# Altium schematic sheet FPGA_IO_4.SchDoc
size A
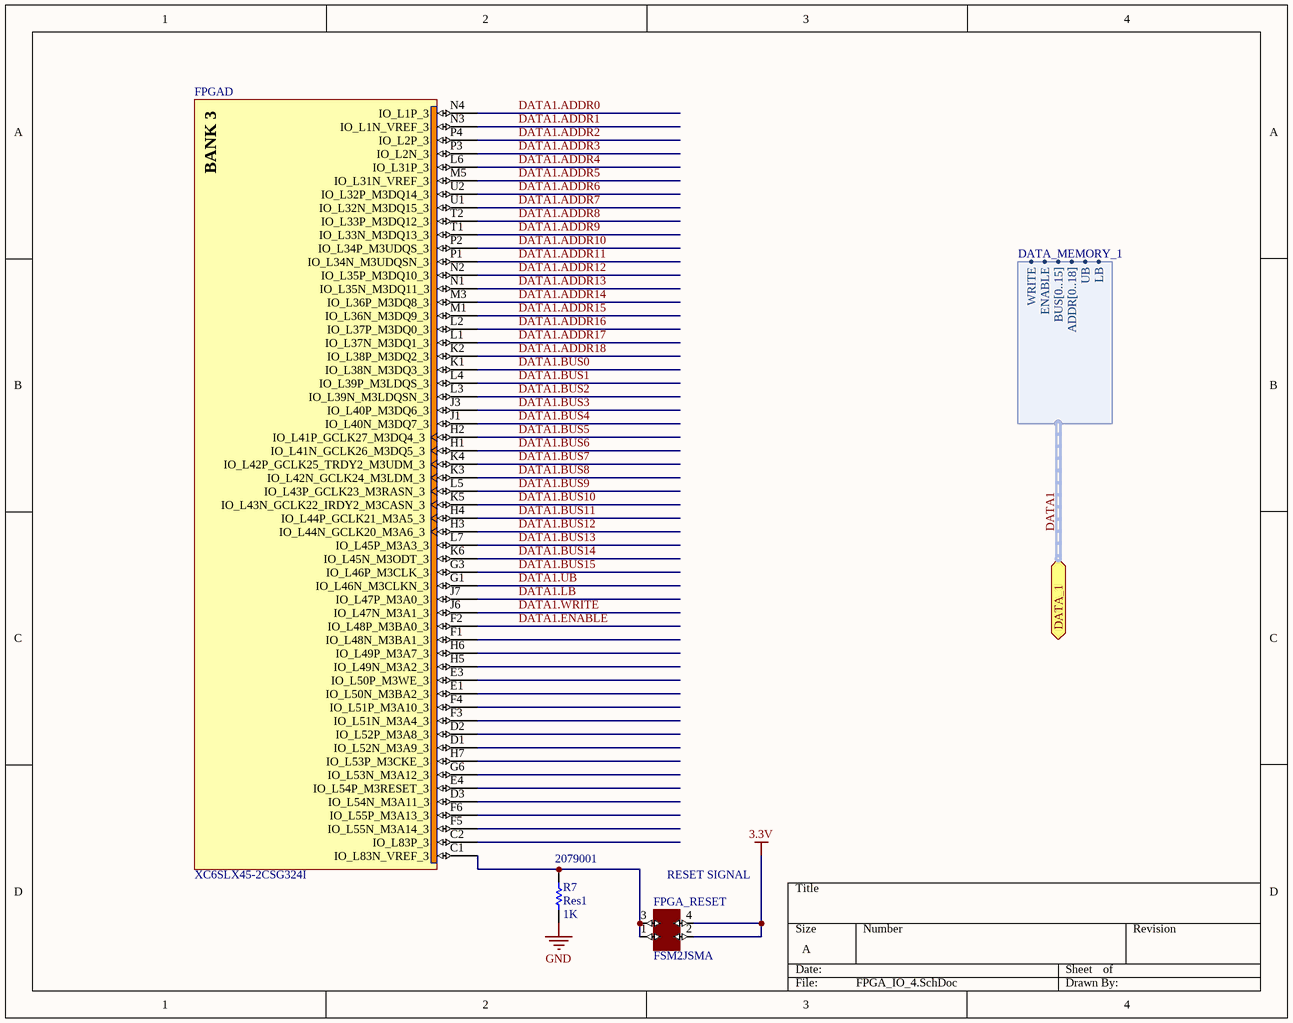
[diagram p0: FPGA_IO_4.SchDoc]

## Parts
FPGA  XC6SLX45-2CSG324I  [CSG324]  (part D of 8)
FPGA_RESET  FSM2JSMA  [Button]
R7  Res1  value 1K  Supplier Part Number 1: 2079001  [C1206]

## Ports
DATA_1 (harness DATA_MEMORY_1)

## Harnesses
DATA_MEMORY_1: WRITE, ENABLE, BUS[0..15], ADDR[0..18], UB, LB

## Nets
3.3V: FPGA_RESET.2 FPGA_RESET.4
GND: R7.2
DATA1.ADDR0: FPGA.N4(IO_L1P_3)
DATA1.ADDR1: FPGA.N3(IO_L1N_VREF_3)
DATA1.ADDR2: FPGA.P4(IO_L2P_3)
DATA1.ADDR3: FPGA.P3(IO_L2N_3)
DATA1.ADDR4: FPGA.L6(IO_L31P_3)
DATA1.ADDR5: FPGA.M5(IO_L31N_VREF_3)
DATA1.ADDR6: FPGA.U2(IO_L32P_M3DQ14_3)
DATA1.ADDR7: FPGA.U1(IO_L32N_M3DQ15_3)
DATA1.ADDR8: FPGA.T2(IO_L33P_M3DQ12_3)
DATA1.ADDR9: FPGA.T1(IO_L33N_M3DQ13_3)
DATA1.ADDR10: FPGA.P2(IO_L34P_M3UDQS_3)
DATA1.ADDR11: FPGA.P1(IO_L34N_M3UDQSN_3)
DATA1.ADDR12: FPGA.N2(IO_L35P_M3DQ10_3)
DATA1.ADDR13: FPGA.N1(IO_L35N_M3DQ11_3)
DATA1.ADDR14: FPGA.M3(IO_L36P_M3DQ8_3)
DATA1.ADDR15: FPGA.M1(IO_L36N_M3DQ9_3)
DATA1.ADDR16: FPGA.L2(IO_L37P_M3DQ0_3)
DATA1.ADDR17: FPGA.L1(IO_L37N_M3DQ1_3)
DATA1.ADDR18: FPGA.K2(IO_L38P_M3DQ2_3)
DATA1.BUS0: FPGA.K1(IO_L38N_M3DQ3_3)
DATA1.BUS1: FPGA.L4(IO_L39P_M3LDQS_3)
DATA1.BUS2: FPGA.L3(IO_L39N_M3LDQSN_3)
DATA1.BUS3: FPGA.J3(IO_L40P_M3DQ6_3)
DATA1.BUS4: FPGA.J1(IO_L40N_M3DQ7_3)
DATA1.BUS5: FPGA.H2(IO_L41P_GCLK27_M3DQ4_3)
DATA1.BUS6: FPGA.H1(IO_L41N_GCLK26_M3DQ5_3)
DATA1.BUS7: FPGA.K4(IO_L42P_GCLK25_TRDY2_M3UDM_3)
DATA1.BUS8: FPGA.K3(IO_L42N_GCLK24_M3LDM_3)
DATA1.BUS9: FPGA.L5(IO_L43P_GCLK23_M3RASN_3)
DATA1.BUS10: FPGA.K5(IO_L43N_GCLK22_IRDY2_M3CASN_3)
DATA1.BUS11: FPGA.H4(IO_L44P_GCLK21_M3A5_3)
DATA1.BUS12: FPGA.H3(IO_L44N_GCLK20_M3A6_3)
DATA1.BUS13: FPGA.L7(IO_L45P_M3A3_3)
DATA1.BUS14: FPGA.K6(IO_L45N_M3ODT_3)
DATA1.BUS15: FPGA.G3(IO_L46P_M3CLK_3)
DATA1.ENABLE: FPGA.F2(IO_L48P_M3BA0_3)
DATA1.LB: FPGA.J7(IO_L47P_M3A0_3)
DATA1.UB: FPGA.G1(IO_L46N_M3CLKN_3)
DATA1.WRITE: FPGA.J6(IO_L47N_M3A1_3)
NetFPGA_C1: FPGA.C1(IO_L83N_VREF_3) FPGA_RESET.1 FPGA_RESET.3 R7.1

Not connected (* = marked no-connect by the designer): FPGA C2(IO_L83P_3) D1(IO_L52N_M3A9_3) D2(IO_L52P_M3A8_3) D3(IO_L54N_M3A11_3) E1(IO_L50N_M3BA2_3) E3(IO_L50P_M3WE_3) E4(IO_L54P_M3RESET_3) F1(IO_L48N_M3BA1_3) F3(IO_L51N_M3A4_3) F4(IO_L51P_M3A10_3) F5(IO_L55N_M3A14_3) F6(IO_L55P_M3A13_3) G6(IO_L53N_M3A12_3) H5(IO_L49N_M3A2_3) H6(IO_L49P_M3A7_3) H7(IO_L53P_M3CKE_3)

## Buses and harness runs
harness DATA1 = port DATA_1

## Notes on the sheet
- (near FPGA_RESET) RESET SIGNAL
- (in symbol CMP-0067-00402-1, part D) BANK 3

## Library data of the parts
FPGA = CMP-0067-00402-1: Spartan-6 LX 1.2V FPGA, 218 User I/Os, 324-Ball Chip-Scale BGA (0.8mm Pitch), Speed Grade 2, Industrial Grade, Pb-Free; Code_JEDEC: MO-275-KKAC-1; PackageDescription: 324-Ball Chip-Scale BGA (CSG324) Package, 0.8 mm Pitch; DatasheetVersion: ver1.6, Nov-2010; PackageVersion: ver1.1, Nov-2009; PackageReference: CSG324
FPGA_RESET = switch-button
R7 = Res1: Resistor; Manufacturer: WELWYN; Manufacturer Part Number: ASC1206-1K0FT5; Description: WELWYN - ASC1206-1K0FT5 - RESISTOR, ANTI SULPHUR, 1206, 1K0; Product Range: WELWYN - ASC Series; Resistance: 1; Power Rating: 250; Resistance Tolerance: ± 1%; Resistor Case Style: 1206 [3216 Metric]; Resistor Element Material: Thick Film; Temperature Coefficient: ± 100; Voltage Rating: 200; SVHC: No SVHC (16-Jun-2014); Resistor Mounting: SMD<!--FANDB--><div class="features-and-benefits-container"></div>; Published: 8-Jun-2000; LatestRevisionDate: 17-Jul-2002; LatestRevisionNote: Re-released for DXP Platform.; PackageReference: AXIAL-0.3; Publisher: Altium Limited; PackageDescription: Axial Device, Thru-Hole; 2 Leads; 0.3 in Pin Spacing; Supplier 1: Farnell; RoHS: YES; Stock 1: 41610; Pricing 1: 100=0,1895, 500=0,1514, 1000=0,1401, 5000=0,1112 (EUR); Packaging: Cut Tape; MSL: -; ComponentLink1URL: http://www.farnell.com/datasheets/1682355.pdf; ComponentLink1Description: http://www.farnell.com/datasheets/1682355.pdf